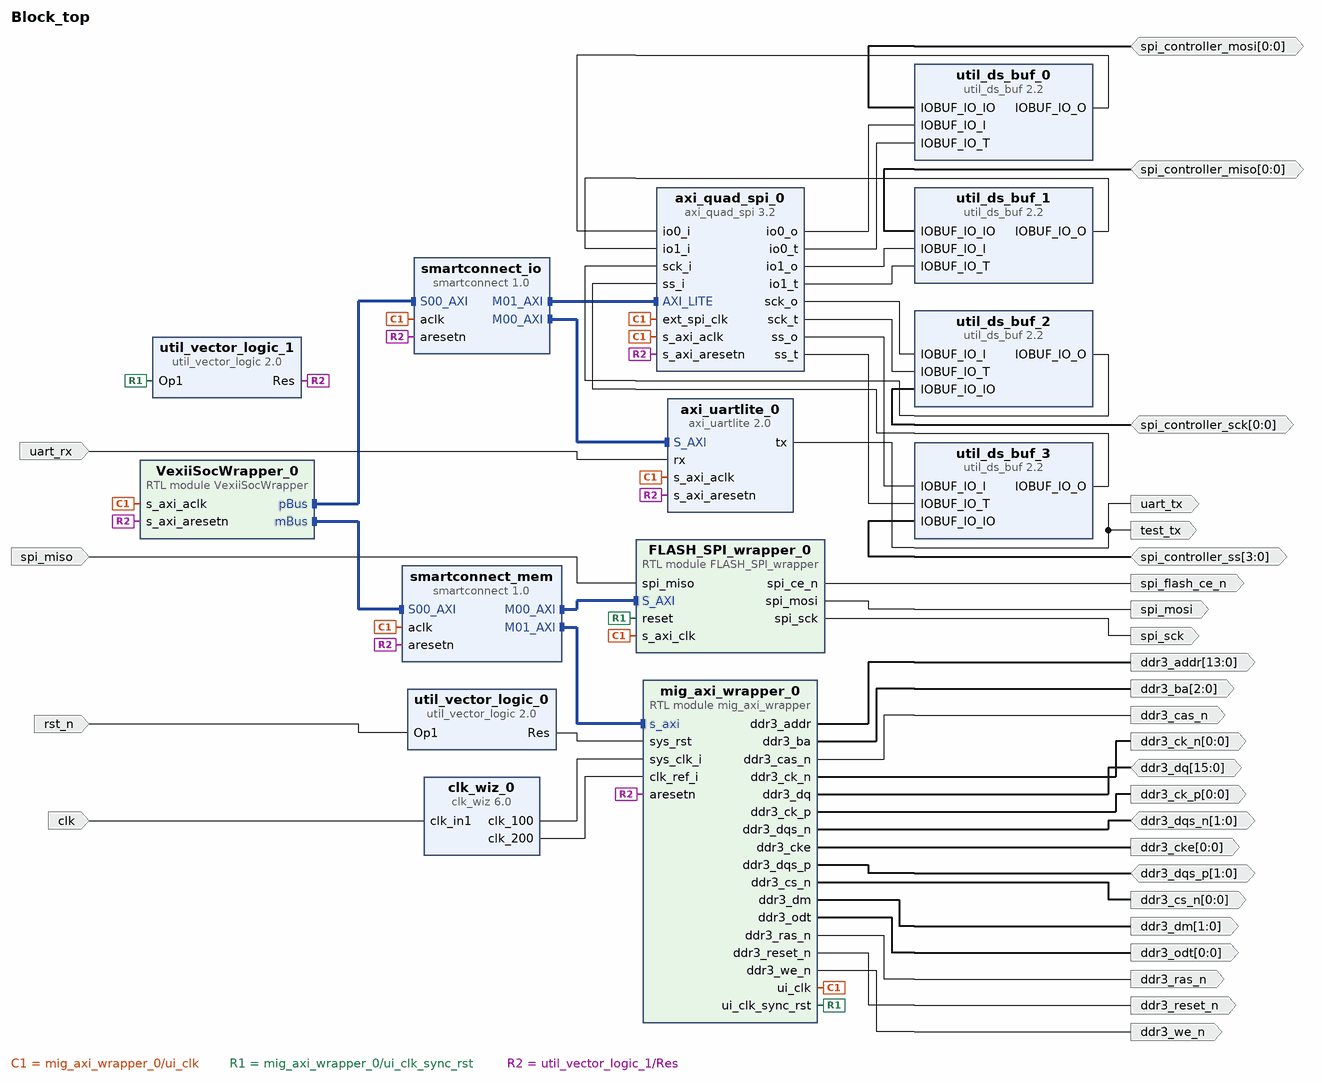
[diagram p0: block diagram of the top level]
# Vivado block design Block_top, xc7a35tftg256-2, Vivado 2025.2
create_bd_design Block_top

create_bd_port -dir IO -from 15 -to 0 ddr3_dq
create_bd_port -dir IO -from 1 -to 0 ddr3_dqs_n
create_bd_port -dir O ddr3_ras_n
create_bd_port -dir IO -from 1 -to 0 ddr3_dqs_p
create_bd_port -dir O -from 13 -to 0 ddr3_addr
create_bd_port -dir O -from 2 -to 0 ddr3_ba
create_bd_port -dir O ddr3_cas_n
create_bd_port -dir O ddr3_reset_n
create_bd_port -dir O -from 0 -to 0 ddr3_ck_p
create_bd_port -dir O -from 0 -to 0 ddr3_ck_n
create_bd_port -dir O -from 0 -to 0 ddr3_cs_n
create_bd_port -dir O -from 0 -to 0 ddr3_odt
create_bd_port -dir O -from 1 -to 0 ddr3_dm
create_bd_port -dir O ddr3_we_n
create_bd_port -dir O -from 0 -to 0 ddr3_cke
create_bd_port -dir I -type rst rst_n
set_property -dict {CONFIG.POLARITY ACTIVE_LOW} [get_bd_ports rst_n]
create_bd_port -dir I -type clk clk
create_bd_port -dir I spi_miso
create_bd_port -dir O spi_mosi
create_bd_port -dir O spi_sck
create_bd_port -dir O spi_flash_ce_n
create_bd_port -dir I uart_rx
create_bd_port -dir O uart_tx
create_bd_port -dir O -type data test_tx
create_bd_port -dir IO -from 0 -to 0 spi_controller_mosi
create_bd_port -dir IO -from 0 -to 0 spi_controller_miso
create_bd_port -dir IO -from 0 -to 0 spi_controller_sck
create_bd_port -dir IO -from 3 -to 0 spi_controller_ss

create_bd_cell -type ip -vlnv xilinx.com:ip:clk_wiz:6.0 clk_wiz_0
set_property -dict [list \
  CONFIG.CLKOUT1_JITTER 144.719 \
  CONFIG.CLKOUT1_PHASE_ERROR 114.212 \
  CONFIG.CLKOUT2_DRIVES No_buffer \
  CONFIG.CLKOUT2_JITTER 126.455 \
  CONFIG.CLKOUT2_PHASE_ERROR 114.212 \
  CONFIG.CLKOUT2_REQUESTED_OUT_FREQ 200.000 \
  CONFIG.CLKOUT2_USED true \
  CONFIG.CLKOUT3_DRIVES No_buffer \
  CONFIG.CLKOUT3_JITTER 251.196 \
  CONFIG.CLKOUT3_PHASE_ERROR 114.212 \
  CONFIG.CLKOUT3_REQUESTED_OUT_FREQ 6.25 \
  CONFIG.CLKOUT3_USED true \
  CONFIG.CLK_OUT1_PORT clk_100 \
  CONFIG.CLK_OUT2_PORT clk_200 \
  CONFIG.CLK_OUT3_PORT clk_6_25 \
  CONFIG.MMCM_CLKFBOUT_MULT_F 8.000 \
  CONFIG.MMCM_CLKOUT0_DIVIDE_F 8.000 \
  CONFIG.MMCM_CLKOUT1_DIVIDE 4 \
  CONFIG.MMCM_CLKOUT2_DIVIDE 128 \
  CONFIG.NUM_OUT_CLKS 3 \
  CONFIG.USE_LOCKED false \
  CONFIG.USE_RESET false \
] [get_bd_cells clk_wiz_0]
create_bd_cell -type ip -vlnv xilinx.com:ip:util_vector_logic:2.0 util_vector_logic_0
set_property -dict {CONFIG.C_OPERATION not CONFIG.C_SIZE 1} [get_bd_cells util_vector_logic_0]
create_bd_cell -type module -reference mig_axi_wrapper mig_axi_wrapper_0
create_bd_cell -type ip -vlnv xilinx.com:ip:util_vector_logic:2.0 util_vector_logic_1
set_property -dict {CONFIG.C_OPERATION not CONFIG.C_SIZE 1} [get_bd_cells util_vector_logic_1]
create_bd_cell -type ip -vlnv xilinx.com:ip:smartconnect:1.0 smartconnect_mem
set_property -dict {CONFIG.NUM_MI 2 CONFIG.NUM_SI 1} [get_bd_cells smartconnect_mem]
create_bd_cell -type module -reference FLASH_SPI_wrapper FLASH_SPI_wrapper_0
create_bd_cell -type ip -vlnv xilinx.com:ip:smartconnect:1.0 smartconnect_io
set_property -dict {CONFIG.NUM_MI 2 CONFIG.NUM_SI 1} [get_bd_cells smartconnect_io]
create_bd_cell -type ip -vlnv xilinx.com:ip:util_ds_buf:2.2 util_ds_buf_0
set_property -dict {CONFIG.C_BUF_TYPE IOBUF} [get_bd_cells util_ds_buf_0]
create_bd_cell -type ip -vlnv xilinx.com:ip:axi_quad_spi:3.2 axi_quad_spi_0
set_property -dict [list \
  CONFIG.C_NUM_SS_BITS 4 \
  CONFIG.C_SCK_RATIO 4 \
  CONFIG.C_USE_STARTUP 0 \
  CONFIG.FIFO_INCLUDED 1 \
  CONFIG.Master_mode 1 \
] [get_bd_cells axi_quad_spi_0]
create_bd_cell -type ip -vlnv xilinx.com:ip:util_ds_buf:2.2 util_ds_buf_1
set_property -dict {CONFIG.C_BUF_TYPE IOBUF} [get_bd_cells util_ds_buf_1]
create_bd_cell -type ip -vlnv xilinx.com:ip:util_ds_buf:2.2 util_ds_buf_2
set_property -dict {CONFIG.C_BUF_TYPE IOBUF} [get_bd_cells util_ds_buf_2]
create_bd_cell -type ip -vlnv xilinx.com:ip:util_ds_buf:2.2 util_ds_buf_3
set_property -dict {CONFIG.C_BUF_TYPE IOBUF CONFIG.C_SIZE 4} [get_bd_cells util_ds_buf_3]
create_bd_cell -type ip -vlnv xilinx.com:ip:axi_uartlite:2.0 axi_uartlite_0
set_property -dict {CONFIG.C_BAUDRATE 115200} [get_bd_cells axi_uartlite_0]
create_bd_cell -type module -reference VexiiSocWrapper VexiiSocWrapper_0

# ---- connections ----

connect_bd_intf_net [get_bd_intf_pins VexiiSocWrapper_0/mBus] [get_bd_intf_pins smartconnect_mem/S00_AXI]
connect_bd_intf_net [get_bd_intf_pins VexiiSocWrapper_0/pBus] [get_bd_intf_pins smartconnect_io/S00_AXI]
connect_bd_intf_net -intf_net smartconnect_0_M00_AXI [get_bd_intf_pins smartconnect_mem/M00_AXI] [get_bd_intf_pins FLASH_SPI_wrapper_0/S_AXI]
connect_bd_intf_net -intf_net smartconnect_0_M01_AXI [get_bd_intf_pins smartconnect_mem/M01_AXI] [get_bd_intf_pins mig_axi_wrapper_0/s_axi]
connect_bd_intf_net [get_bd_intf_pins smartconnect_io/M00_AXI] [get_bd_intf_pins axi_uartlite_0/S_AXI]
connect_bd_intf_net [get_bd_intf_pins smartconnect_io/M01_AXI] [get_bd_intf_pins axi_quad_spi_0/AXI_LITE]
connect_bd_net [get_bd_pins FLASH_SPI_wrapper_0/spi_ce_n] [get_bd_ports spi_flash_ce_n]
connect_bd_net [get_bd_pins FLASH_SPI_wrapper_0/spi_mosi] [get_bd_ports spi_mosi]
connect_bd_net [get_bd_pins FLASH_SPI_wrapper_0/spi_sck] [get_bd_ports spi_sck]
connect_bd_net [get_bd_ports ddr3_dq] [get_bd_pins mig_axi_wrapper_0/ddr3_dq]
connect_bd_net [get_bd_ports ddr3_dqs_n] [get_bd_pins mig_axi_wrapper_0/ddr3_dqs_n]
connect_bd_net [get_bd_ports ddr3_dqs_p] [get_bd_pins mig_axi_wrapper_0/ddr3_dqs_p]
connect_bd_net [get_bd_ports spi_controller_mosi] [get_bd_pins util_ds_buf_0/IOBUF_IO_IO]
connect_bd_net [get_bd_ports spi_controller_miso] [get_bd_pins util_ds_buf_1/IOBUF_IO_IO]
connect_bd_net [get_bd_ports spi_controller_sck] [get_bd_pins util_ds_buf_2/IOBUF_IO_IO]
connect_bd_net [get_bd_ports spi_controller_ss] [get_bd_pins util_ds_buf_3/IOBUF_IO_IO]
connect_bd_net [get_bd_pins axi_quad_spi_0/io0_o] [get_bd_pins util_ds_buf_0/IOBUF_IO_I]
connect_bd_net [get_bd_pins axi_quad_spi_0/io0_t] [get_bd_pins util_ds_buf_0/IOBUF_IO_T]
connect_bd_net [get_bd_pins axi_quad_spi_0/io1_o] [get_bd_pins util_ds_buf_1/IOBUF_IO_I]
connect_bd_net [get_bd_pins axi_quad_spi_0/io1_t] [get_bd_pins util_ds_buf_1/IOBUF_IO_T]
connect_bd_net [get_bd_pins axi_quad_spi_0/sck_o] [get_bd_pins util_ds_buf_2/IOBUF_IO_I]
connect_bd_net [get_bd_pins axi_quad_spi_0/sck_t] [get_bd_pins util_ds_buf_2/IOBUF_IO_T]
connect_bd_net [get_bd_pins axi_quad_spi_0/ss_o] [get_bd_pins util_ds_buf_3/IOBUF_IO_I]
connect_bd_net [get_bd_pins axi_quad_spi_0/ss_t] [get_bd_pins util_ds_buf_3/IOBUF_IO_T]
connect_bd_net -net axi_uart16550_0_sout [get_bd_pins axi_uartlite_0/tx] [get_bd_ports uart_tx] [get_bd_ports test_tx]
connect_bd_net -net clk_in1_0_1 [get_bd_ports clk] [get_bd_pins clk_wiz_0/clk_in1]
connect_bd_net [get_bd_pins clk_wiz_0/clk_100] [get_bd_pins mig_axi_wrapper_0/sys_clk_i]
connect_bd_net [get_bd_pins clk_wiz_0/clk_200] [get_bd_pins mig_axi_wrapper_0/clk_ref_i]
connect_bd_net [get_bd_pins mig_axi_wrapper_0/ddr3_addr] [get_bd_ports ddr3_addr]
connect_bd_net [get_bd_pins mig_axi_wrapper_0/ddr3_ba] [get_bd_ports ddr3_ba]
connect_bd_net [get_bd_pins mig_axi_wrapper_0/ddr3_cas_n] [get_bd_ports ddr3_cas_n]
connect_bd_net [get_bd_pins mig_axi_wrapper_0/ddr3_ck_n] [get_bd_ports ddr3_ck_n]
connect_bd_net [get_bd_pins mig_axi_wrapper_0/ddr3_ck_p] [get_bd_ports ddr3_ck_p]
connect_bd_net [get_bd_pins mig_axi_wrapper_0/ddr3_cke] [get_bd_ports ddr3_cke]
connect_bd_net [get_bd_pins mig_axi_wrapper_0/ddr3_cs_n] [get_bd_ports ddr3_cs_n]
connect_bd_net [get_bd_pins mig_axi_wrapper_0/ddr3_dm] [get_bd_ports ddr3_dm]
connect_bd_net [get_bd_pins mig_axi_wrapper_0/ddr3_odt] [get_bd_ports ddr3_odt]
connect_bd_net [get_bd_pins mig_axi_wrapper_0/ddr3_ras_n] [get_bd_ports ddr3_ras_n]
connect_bd_net [get_bd_pins mig_axi_wrapper_0/ddr3_reset_n] [get_bd_ports ddr3_reset_n]
connect_bd_net [get_bd_pins mig_axi_wrapper_0/ddr3_we_n] [get_bd_ports ddr3_we_n]
connect_bd_net [get_bd_pins mig_axi_wrapper_0/ui_clk] \
  [get_bd_pins smartconnect_mem/aclk] [get_bd_pins smartconnect_io/aclk] [get_bd_pins FLASH_SPI_wrapper_0/s_axi_clk] \
  [get_bd_pins axi_quad_spi_0/s_axi_aclk] [get_bd_pins axi_uartlite_0/s_axi_aclk] [get_bd_pins axi_quad_spi_0/ext_spi_clk] \
  [get_bd_pins VexiiSocWrapper_0/s_axi_aclk]
connect_bd_net -net reset [get_bd_pins mig_axi_wrapper_0/ui_clk_sync_rst] \
  [get_bd_pins util_vector_logic_1/Op1] [get_bd_pins FLASH_SPI_wrapper_0/reset]
connect_bd_net -net reset_n [get_bd_pins util_vector_logic_1/Res] \
  [get_bd_pins smartconnect_mem/aresetn] [get_bd_pins smartconnect_io/aresetn] [get_bd_pins mig_axi_wrapper_0/aresetn] \
  [get_bd_pins axi_quad_spi_0/s_axi_aresetn] [get_bd_pins axi_uartlite_0/s_axi_aresetn] \
  [get_bd_pins VexiiSocWrapper_0/s_axi_aresetn]
connect_bd_net -net rst_in [get_bd_pins util_vector_logic_0/Res] [get_bd_pins mig_axi_wrapper_0/sys_rst]
connect_bd_net -net rst_n_in [get_bd_ports rst_n] [get_bd_pins util_vector_logic_0/Op1]
connect_bd_net -net spi_miso_0_1 [get_bd_ports spi_miso] [get_bd_pins FLASH_SPI_wrapper_0/spi_miso]
connect_bd_net [get_bd_ports uart_rx] [get_bd_pins axi_uartlite_0/rx]
connect_bd_net [get_bd_pins util_ds_buf_0/IOBUF_IO_O] [get_bd_pins axi_quad_spi_0/io0_i]
connect_bd_net [get_bd_pins util_ds_buf_1/IOBUF_IO_O] [get_bd_pins axi_quad_spi_0/io1_i]
connect_bd_net [get_bd_pins util_ds_buf_2/IOBUF_IO_O] [get_bd_pins axi_quad_spi_0/sck_i]
connect_bd_net [get_bd_pins util_ds_buf_3/IOBUF_IO_O] [get_bd_pins axi_quad_spi_0/ss_i]

# ---- address map ----
assign_bd_address -offset 0x80000000 -range 1M -target_address_space [get_bd_addr_spaces VexiiSocWrapper_0/mBus] [get_bd_addr_segs FLASH_SPI_wrapper_0/S_AXI/reg0]
assign_bd_address -offset 0x90000000 -range 256M -target_address_space [get_bd_addr_spaces VexiiSocWrapper_0/mBus] [get_bd_addr_segs mig_axi_wrapper_0/s_axi/reg0]
assign_bd_address -offset 0x10000000 -range 4K -target_address_space [get_bd_addr_spaces VexiiSocWrapper_0/pBus] [get_bd_addr_segs axi_uartlite_0/S_AXI/Reg]
assign_bd_address -offset 0x10001000 -range 4K -target_address_space [get_bd_addr_spaces VexiiSocWrapper_0/pBus] [get_bd_addr_segs axi_quad_spi_0/AXI_LITE/Reg]

validate_bd_design
save_bd_design
